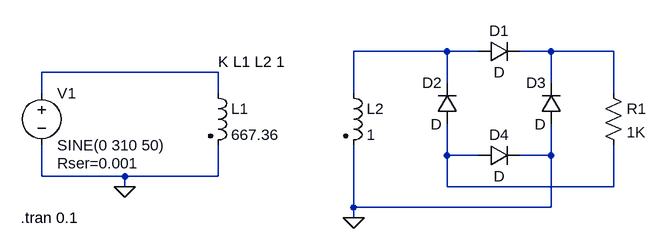
[diagram p0: schematic 1_2.asc]
1_2.asc, the LTspice schematic file:
Version 4
SHEET 1 1160 680
WIRE 560 48 416 48
WIRE 608 48 560 48
WIRE 720 48 672 48
WIRE 816 48 720 48
WIRE 208 80 -64 80
WIRE 560 96 560 48
WIRE 720 96 720 48
WIRE -64 112 -64 80
WIRE 208 112 208 80
WIRE 416 112 416 48
WIRE 816 112 816 48
WIRE 560 208 560 160
WIRE 608 208 560 208
WIRE 720 208 720 160
WIRE 720 208 672 208
WIRE -64 240 -64 192
WIRE 64 240 -64 240
WIRE 208 240 208 192
WIRE 208 240 64 240
WIRE 64 256 64 240
WIRE 560 256 560 208
WIRE 816 256 816 192
WIRE 816 256 560 256
WIRE 416 288 416 192
WIRE 720 288 720 208
WIRE 720 288 416 288
WIRE 416 304 416 288
FLAG 64 256 0
FLAG 416 304 0
SYMBOL voltage -64 96 R0
WINDOW 123 0 0 Left 2
WINDOW 39 24 124 Left 2
SYMATTR SpiceLine Rser=0.001
SYMATTR InstName V1
SYMATTR Value SINE(0 310 50)
SYMBOL ind2 192 96 R0
SYMATTR InstName L1
SYMATTR Value 667.36
SYMATTR Type ind
SYMBOL res 800 96 R0
SYMATTR InstName R1
SYMATTR Value 1K
SYMBOL ind2 400 96 R0
SYMATTR InstName L2
SYMATTR Value 1
SYMATTR Type ind
SYMBOL diode 608 64 R270
WINDOW 0 32 32 VTop 2
WINDOW 3 0 32 VBottom 2
SYMATTR InstName D1
SYMBOL diode 576 160 R180
WINDOW 0 24 64 Left 2
WINDOW 3 24 0 Left 2
SYMATTR InstName D2
SYMBOL diode 736 160 R180
WINDOW 0 24 64 Left 2
WINDOW 3 24 0 Left 2
SYMATTR InstName D3
SYMBOL diode 608 224 R270
WINDOW 0 32 32 VTop 2
WINDOW 3 0 32 VBottom 2
SYMATTR InstName D4
TEXT 208 64 Left 2 !K L1 L2 1
TEXT -96 304 Left 2 !.tran 0.1

The netlist it stands for:
* 1_2.asc
V1 N003 0 SINE(0 310 50) Rser=0.001
L1 N003 0 667.36
R1 N002 N004 1K
L2 N001 0 1
D1 N001 N002 D
D2 N004 N001 D
D3 0 N002 D
D4 N004 0 D
.model D D
.lib standard.dio
K L1 L2 1
.tran 0.1
.backanno
.end